# Altium schematic sheet [04] - SiPM Bias Voltage Supply.SchDoc
size A4; Address1: III. Physikalisches Institut B; Address2: RWTH Aachen University; Address3: Otto-Blumenthal-Strasse; Address4: 52074 Aachen, GERMANY; DocumentNumber: 5; SheetNumber: 5; SheetTotal: 6
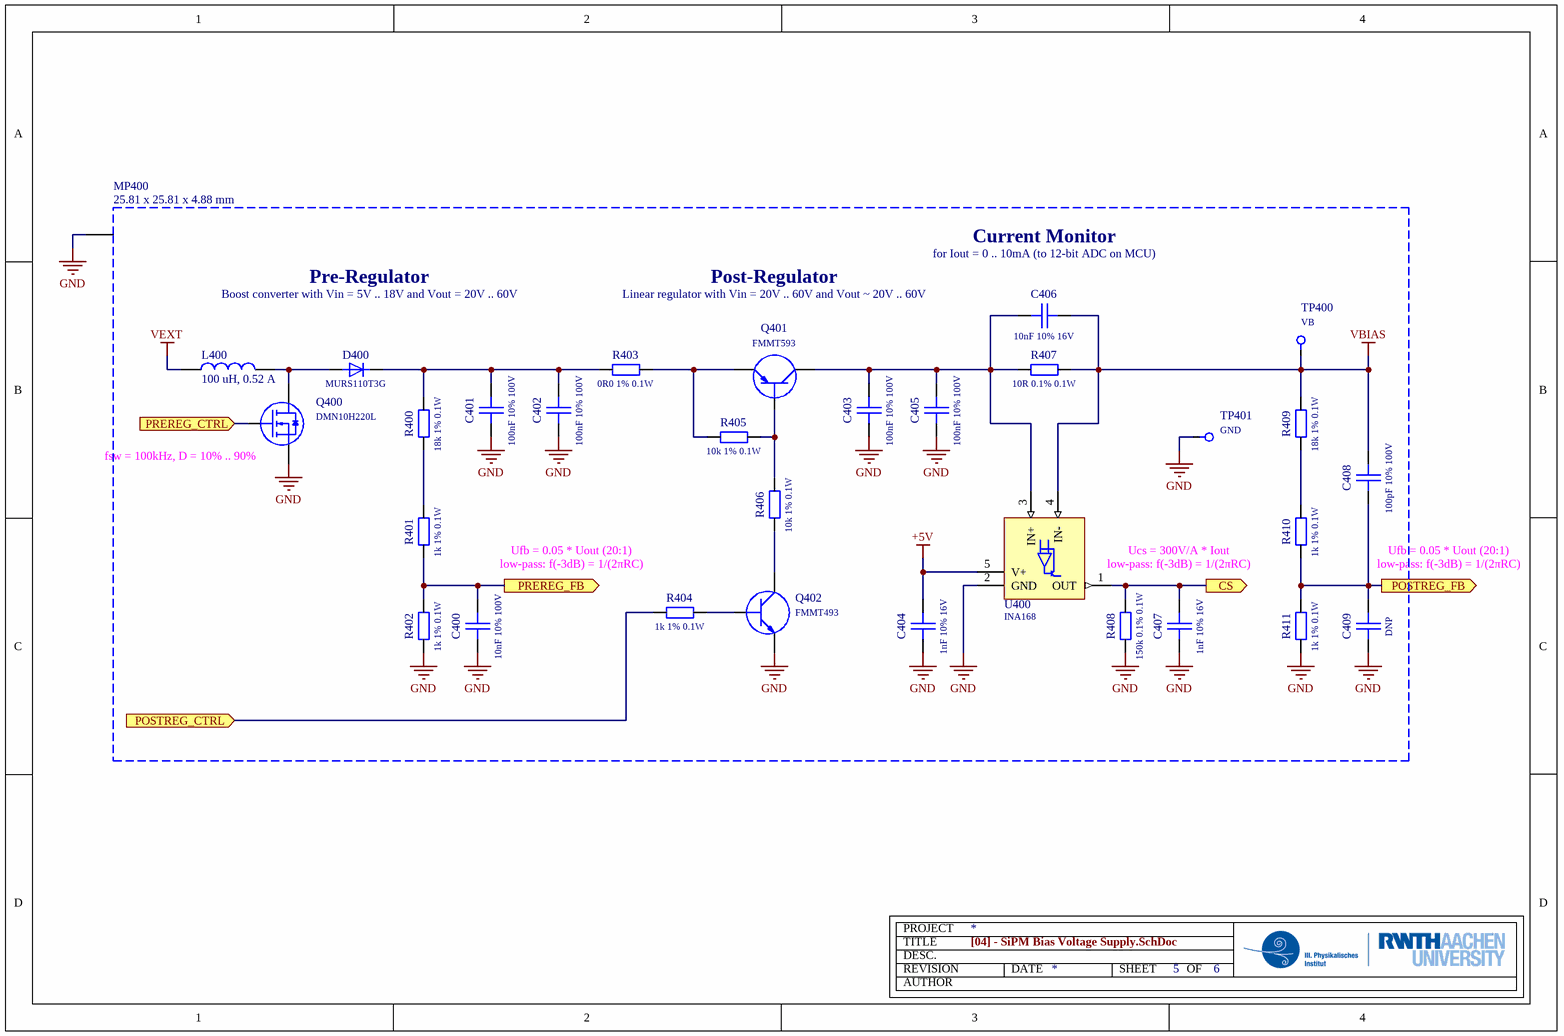
[diagram p0: [04] - SiPM Bias Voltage Supply.SchDoc]

## Parts
C400  10nF 10% 100V  [0603_CAP]
C401  100nF 10% 100V  [0603_CAP]
C402  100nF 10% 100V  [0603_CAP]
C403  100nF 10% 100V  [0603_CAP]
C404  1nF 10% 16V  [0603_CAP]
C405  100nF 10% 100V  [0603_CAP]
C406  10nF 10% 16V  [0603_CAP]
C407  1nF 10% 16V  [0603_CAP]
C408  100pF 10% 100V  [0603_CAP]
C409  DNP  [0603_CAP]
D400  MURS110T3G  [DO-214AA (SMB)]
L400  100 uH, 0.52 A  [WE-SPC_4838]
MP400  25.81 x 25.81 x 4.88 mm  [SMD Frame_36105266S]
Q400  DMN10H220L  [SOT-23 (TO-236)]
Q401  FMMT593  [SOT-23 (TO-236)]
Q402  FMMT493  [SOT-23 (TO-236)]
R400  18k 1% 0.1W  [0603_RES]
R401  1k 1% 0.1W  [0603_RES]
R402  1k 1% 0.1W  [0603_RES]
R403  0R0 1% 0.1W  [0603_RES]
R404  1k 1% 0.1W  [0603_RES]
R405  10k 1% 0.1W  [0603_RES]
R406  10k 1% 0.1W  [0603_RES]
R407  10R 0.1% 0.1W  [0603_RES]
R408  150k 0.1% 0.1W  [0603_RES]
R409  18k 1% 0.1W  [0603_RES]
R410  1k 1% 0.1W  [0603_RES]
R411  1k 1% 0.1W  [0603_RES]
TP400  VB  [Testpoint_5000]
TP401  GND  [Testpoint_5001]
U400  INA168  [SOT-23-5]

## Ports
CS (out), POSTREG_CTRL (in), POSTREG_FB (out), PREREG_CTRL (in), PREREG_FB (out)

## Nets
+5V: C404.2 U400.5(V+)
GND: C400.1 C401.1 C402.1 C403.1 C404.1 C405.1 C407.1 C409.1 MP400.1 Q400.2(S) Q402.2(E) R402.2 R408.2 R411.2 TP401.1 U400.2(GND)
VBIAS: C406.2 C408.2 R407.1 R409.1 TP400.1 U400.4(IN-)
VEXT: L400.1
CS: C407.2 R408.1 U400.1(OUT) ; port CS
POSTREG_CTRL: R404.2 ; port POSTREG_CTRL
POSTREG_FB: C408.1 C409.2 R410.2 R411.1 ; port POSTREG_FB
PREREG_CTRL: Q400.1(G) ; port PREREG_CTRL
PREREG_FB: C400.2 R401.2 R402.1 ; port PREREG_FB
NetC401_2: C401.2 C402.2 D400.1(K) R400.1 R403.2
NetC403_2: C403.2 C405.2 C406.1 Q401.3(C) R407.2 U400.3(IN+)
NetD400_2: D400.2(A) L400.2 Q400.3(D)
NetQ401_1: Q401.1(B) R405.1 R406.1
NetQ401_2: Q401.2(E) R403.1 R405.2
NetQ402_1: Q402.1(B) R404.1
NetQ402_3: Q402.3(C) R406.2
NetR400_2: R400.2 R401.1
NetR409_2: R409.2 R410.1

## Notes on the sheet
- Current Monitor
- Pre-Regulator
- Boost converter with Vin = 5V .. 18V and Vout = 20V .. 60V
- Post-Regulator
- Linear regulator with Vin = 20V .. 60V and Vout ~ 20V .. 60V
- for Iout = 0 .. 10mA (to 12-bit ADC on MCU)
- (near Q400) fsw = 100kHz, D = 10% .. 90%
- Ufb = 0.05 * Uout (20:1)
- low-pass: f(-3dB) = 1/(2πRC)
- Ucs = 300V/A * Iout
- (near U400) low-pass: f(-3dB) = 1/(2πRC)
- (near C409) low-pass: f(-3dB) = 1/(2πRC)
- TITLE
- REVISION
- PROJECT
- AUTHOR
- DESC.
- DATE
- SHEET
- OF

## Library data of the parts
C400-C409 = Capacitor: Simple generic capacitor.; PackageReference: 0603
  C400: Value: 10nF 10% 100V
  C401-C403 C405: Value: 100nF 10% 100V
  C404 C407: Value: 1nF 10% 16V
  C406: Value: 10nF 10% 16V
  C408: Value: 100pF 10% 100V
  C409: Value: DNP
D400 = Diode: Simple generic diode.; Manufacturer: ON Semiconductor; PackageReference: DO-214AA (SMB); PartNumber: MURS110T3G; Value: MURS110T3G
L400 = 74408943101: SMT Shielded Power Inductor WE-SPC, size 4838, 100 uH, 0.52 A; Rated Current: 0.52 A; Inductance: 100 uH; DC Resistance max.: 0.85 Ohm; Self Resonant Frequency: 7.8 MHz; Saturation Current: 0.68 A; ComponentLink1Description: Manufacturer; ComponentLink1URL: http://www.we-online.de; ComponentLink2Description: Datasheet; ComponentLink2URL: https://katalog.we-online.com/pbs/datasheet/74408943101.pdf; Part Number: 74408943101; Published Date: December 2018; Publisher: Wurth Elektronik; Size: 4838; Operating Temperature: -40 to +125 degC; Mounting Technology: SMT; Packaging: Tape and Reel
MP400 = 36105266S: WE-SHC Shielding Cabinet, SMD Frame, 25.81 x 25.81 x 4.88 mm; ComponentLink1Description: Manufacturer; ComponentLink1URL: http://www.we-online.de; ComponentLink2Description: Datasheet; ComponentLink2URL: http://katalog.we-online.de/pbs/datasheet/36105266S.pdf; Part Number: 36105266S; Published Date: Dec. 2017; Publisher: Wurth Elektronik; Length: 25.81 mm; Width: 25.81 mm; Height: 4.88 mm
Q400 = MOSFET_DN: 100V N-CHANNEL ENHANCEMENT MODE MOSFET; Manufacturer: Diodes Incorporated; PackageReference: SOT23; PartNumber: DMN10H220L; Value: DMN10H220L
Q401 = BJT_PNP: Generic Bipolar PNP Transistor; Manufacturer: Diodes Incorporated; PartNumber: FMMT593TA; PackageReference: SOT23; Value: FMMT593
Q402 = BJT_NPN: 100V NPN MEDIUM POWER TRANSISTOR IN SOT23; Manufacturer: Diodes Incorporated; PartNumber: FMMT493TA; PackageReference: SOT23; Value: FMMT493
R400-R411 = Resistor: Simple generic resistor.; PackageReference: 0603
  R400 R409: Value: 18k 1% 0.1W
  R401 R402 R404 R410 R411: Value: 1k 1% 0.1W
  R403: Value: 0R0 1% 0.1W
  R405 R406: Value: 10k 1% 0.1W
  R407: Value: 10R 0.1% 0.1W
  R408: Value: 150k 0.1% 0.1W
TP400 = Testpoint: Red PC Test Point, Miniature Phosphor Bronze, Silver Plating 0.040" (1.02mm) Hole Diameter Mounting Type.; Manufacturer: Keystone Electronics; PartNumber: 5000; PackageReference: Test Point; Value: VB
TP401 = Testpoint: Red PC Test Point, Miniature Phosphor Bronze, Silver Plating 0.040" (1.02mm) Hole Diameter Mounting Type.; Manufacturer: Keystone Electronics; PartNumber: 500X; PackageReference: Test Point; Value: GND
U400 = INA168: INA1x8 High-Side Measurement Current Shunt Monitor, input 2.7V to 60V.; Manufacturer: Texas Instruments; PartNumber: INA168NA/250; PackageReference: SOT-23-5; Value: INA168